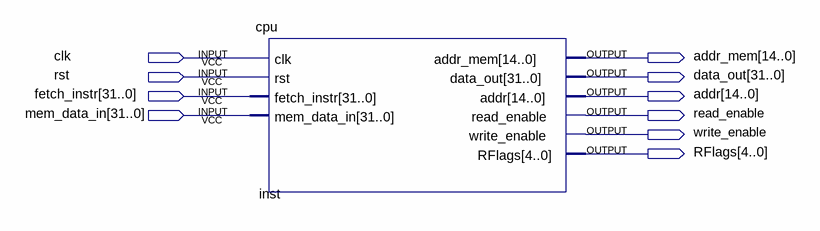
[diagram p0: schematic sheet]
// Quartus schematic processor.bdf as structural Verilog: 1 symbols, 10 pins
module processor (
  input  clk,
  input  rst,
  input  [31:0] fetch_instr,
  input  [31:0] mem_data_in,
  output [14:0] addr_mem,
  output [31:0] data_out,
  output [14:0] addr,
  output read_enable,
  output write_enable,
  output [4:0] RFlags
);

  cpu inst (
    .clk(clk), .rst(rst), .fetch_instr(fetch_instr), .mem_data_in(mem_data_in), .addr_mem(addr_mem),
    .data_out(data_out), .addr(addr), .read_enable(read_enable), .write_enable(write_enable), .RFlags(RFlags));
endmodule
